# EAGLE schematic DSL 40 switcher MIDI external components (EAGLE 9.6.2)
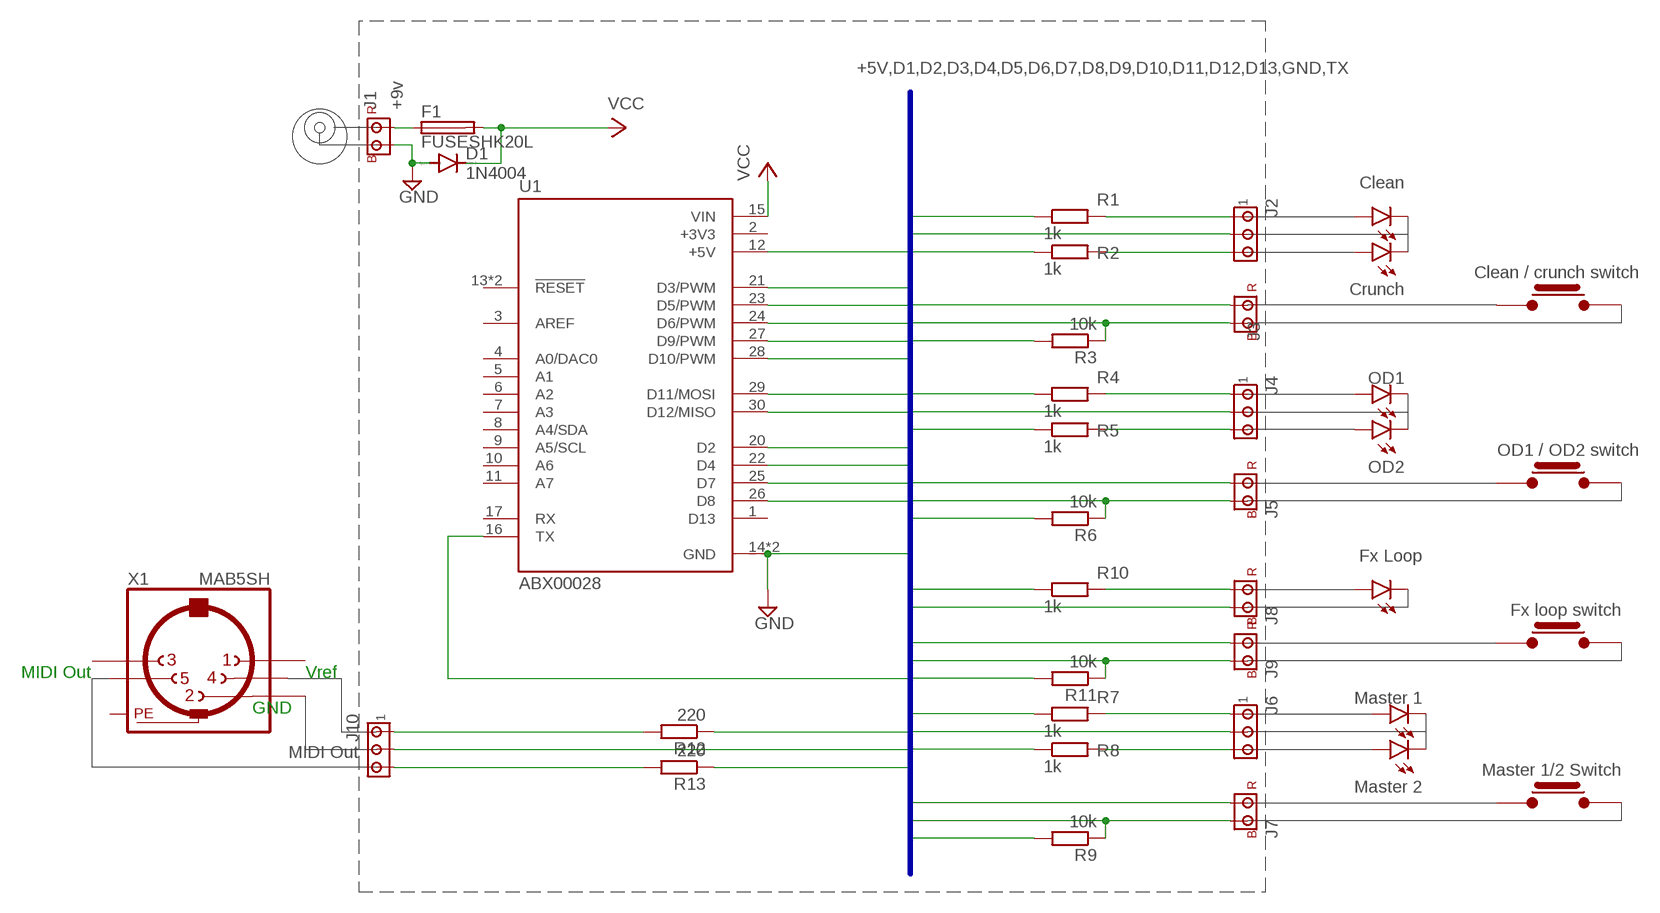
[diagram p0: schematic, sheet 1]

## Parts
D1  1N4004  [DO41-10]
F1  FUSESHK20L  [SHK20L]
J1  +9v  CONNECTOR-JST-2-2.54  [CONNECTOR-JST-2-2.54]
J2  Clean / crunch leds + synch ( 5 sec. )  CONNECTOR-JST-3-2.54  [CONNECTOR-JST-3-2.54]
J3  Clean / crunch switch  CONNECTOR-JST-2-2.54  [CONNECTOR-JST-2-2.54]
J4  OD1 / OD2 Led  CONNECTOR-JST-3-2.54  [CONNECTOR-JST-3-2.54]
J5  OD1 / OD2 switch  CONNECTOR-JST-2-2.54  [CONNECTOR-JST-2-2.54]
J6  Master 1 / 2 Led  CONNECTOR-JST-3-2.54  [CONNECTOR-JST-3-2.54]
J7  Master 1/2 Switch  CONNECTOR-JST-2-2.54  [CONNECTOR-JST-2-2.54]
J8  Fx loop Led  CONNECTOR-JST-2-2.54  [CONNECTOR-JST-2-2.54]
J9  Fx loop switch  CONNECTOR-JST-2-2.54  [CONNECTOR-JST-2-2.54]
J10  MIDI Out  CONNECTOR-JST-3-2.54  [CONNECTOR-JST-3-2.54]
J11  SWITCH-TEMPORARY-ON  [CONNECTOR-JST-2]
J12  SWITCH-TEMPORARY-ON  [CONNECTOR-JST-2]
J13  SWITCH-TEMPORARY-ON  [CONNECTOR-JST-2]
J14  SWITCH-TEMPORARY-ON  [CONNECTOR-JST-2]
LED1  Clean  LED3MM  [LED3MM]
LED2  Crunch  LED3MM  [LED3MM]
LED3  OD1  LED3MM  [LED3MM]
LED4  OD2  LED3MM  [LED3MM]
LED5  Fx Loop  LED3MM  [LED3MM]
LED6  Master 1  LED3MM  [LED3MM]
LED7  Master 2  LED3MM  [LED3MM]
R1  1k  R-EU_0207/10  [0207/10]
R2  1k  R-EU_0207/10  [0207/10]
R3  10k  R-EU_0207/10  [0207/10]
R4  1k  R-EU_0207/10  [0207/10]
R5  1k  R-EU_0207/10  [0207/10]
R6  10k  R-EU_0207/10  [0207/10]
R7  1k  R-EU_0207/10  [0207/10]
R8  1k  R-EU_0207/10  [0207/10]
R9  10k  R-EU_0207/10  [0207/10]
R10  1k  R-EU_0207/10  [0207/10]
R11  10k  R-EU_0207/10  [0207/10]
R12  220  R-EU_0207/10  [0207/10]
R13  220  R-EU_0207/10  [0207/10]
U1  ABX00028  [MODULE_ABX00028]
X1  MAB5SH  [MAB5SH]

## Nets
+5V: J3.RED J5.RED J7.RED J9.RED R12.1 U1.12(+5V)
D2: J3.BLACK R3.1 U1.20(D2)
D3: R2.1 U1.21(D3/PWM)
D4: R1.1 U1.22(D4)
D5: J5.BLACK R6.1 U1.23(D5/PWM)
D6: R5.1 U1.24(D6/PWM)
D7: R4.1 U1.25(D7)
D8: J7.BLACK R9.1 U1.26(D8)
D9: R8.1 U1.27(D9/PWM)
D10: R7.1 U1.28(D10/PWM)
D11: R10.1 U1.29(D11/MOSI)
D12: J9.BLACK R11.1 U1.30(D12/MISO)
GND: D1.A J1.BLACK J2.BLACK J4.BLACK J6.BLACK J8.BLACK J10.BLACK R3.2 R6.2 R9.2 R11.2 U1.14(GND) U1.19(GND)
N$1: J2.YELLOW R2.2
N$2: J2.RED R1.2
N$3: J4.YELLOW R5.2
N$4: J4.RED R4.2
N$5: J8.RED R10.2
N$6: J6.RED R7.2
N$7: J6.YELLOW R8.2
N$8: J10.RED R12.2
N$9: J10.YELLOW R13.2
N$10: F1.1A J1.RED
TX: R13.1 U1.16(TX)
VCC: D1.C F1.2A U1.15(VIN)
Unconnected: J11.BLACK J11.RED J12.BLACK J12.RED J13.BLACK J13.RED J14.BLACK J14.RED LED1.A LED1.K(C) LED2.A LED2.K(C) LED3.A LED3.K(C) LED4.A LED4.K(C) LED5.A LED5.K(C) LED6.A LED6.K(C) LED7.A LED7.K(C) U1.1(D13) U1.3(AREF) U1.4(A0/DAC0) U1.5(A1) U1.6(A2) U1.7(A3) U1.8(A4/SDA) U1.9(A5/SCL) U1.10(A6) U1.11(A7) U1.13(!RESET) U1.17(RX) U1.18(!RESET) X1.1 X1.2 X1.3 X1.4 X1.5

## Buses
+5V,D1,D2,D3,D4,D5,D6,D7,D8,D9,D10,D11,D12,D13,GND,TX

## Notes on the sheet
- MIDI Out | Vref
- GND

## Power pins joined to a net without a drawn wire
+3V3: U1.2(+3V3)
PE: X1.PE X1.PE@(PE)

## Library data of the parts
D1 = diode:1N4004: DIODE general purpose rectifier, 1 A
F1 = fuse:FUSE: Fuse; OC_FARNELL: unknown; OC_NEWARK: unknown
J1 J3 J5 J7-J9 = christophe:CONNECTOR-JST-2-2.54: AMP connector
J2 J4 J6 J10 = christophe:CONNECTOR-JST-3-2.54: AMP connector
J11-J14 = christophe:SWITCH-TEMPORARY-ON
LED1-LED7 = led:LED: LED OSRAM: - CHIPLED LG R971, LG N971, LY N971, LG Q971, LY Q971, LO R971, LY R971 LH N974, LH R974 LS Q976, LO Q976, LY Q976 LO Q996 - Hyper CHIPLED LW Q18S LB Q993, LB Q99A, LB R99A - SideLED LS A670, LO A670, LY A670, LG A670, LP A670 LB A673, LV A673, LT A673, LW A673 LH A674 LY A675 LS A676, LA A676, LO A676, LY A676, LW A676 LS A679, LY A679, LG A679 - Hyper Micro SIDELED® LS Y876, LA Y876, LO Y876, LY Y876 LT Y87S - SmartLED LW L88C, LW L88S LB L89C, LB L89S, LG L890 LS L89K, LO L89K, LY L89K LS L896, LA L896, LO L896, LY L896 - TOPLED LS T670, LO T670, LY T670, LG T670, LP T670 LSG T670, LSP T670, LSY T670, LOP T670, LYG T670 LG T671, LOG T671, LSG T671 LB T673, LV T673, LT T673, LW T673 LH T674 LS T676, LA T676, LO T676, LY T676, LB T676, LH T676, LSB T676, LW T676 LB T67C, LV T67C, LT T67C, LS T67K, LO T67K, LY T67K, LW E67C LS E67B, LA E67B, LO E67B, LY E67B, LB E67C, LV E67C, LT E67C LW T67C LS T679, LY T679, LG T679 LS T770, LO T770, LY T770, LG T770, LP T770 LB T773, LV T773, LT T773, LW T773 LH T774 LS E675, LA E675, LY E675, LS T675 LS T776, LA T776, LO T776, LY T776, LB T776 LHGB T686 LT T68C, LB T68C - Hyper Mini TOPLED® LB M676 - Mini TOPLED Santana® LG M470 LS M47K, LO M47K, LY M47K Source: http://www.osram.convergy.de LUXEON: - LUMILED® LXK2-PW12-R00, LXK2-PW12-S00, LXK2-PW14-U00, LXK2-PW14-V00 LXK2-PM12-R00, LXK2-PM12-S00, LXK2-PM14-U00 LXK2-PE12-Q00, LXK2-PE12-R00, LXK2-PE12-S00, LXK2-PE14-T00, LXK2-PE14-U00 LXK2-PB12-K00, LXK2-PB12-L00, LXK2-PB12-M00, LXK2-PB14-N00, LXK2-PB14-P00, LXK2-PB14-Q00 LXK2-PR12-L00, LXK2-PR12-M00, LXK2-PR14-Q00, LXK2-PR14-R00 LXK2-PD12-Q00, LXK2-PD12-R00, LXK2-PD12-S00 LXK2-PH12-R00, LXK2-PH12-S00 LXK2-PL12-P00, LXK2-PL12-Q00, LXK2-PL12-R00 Source: www.luxeon.com KINGBRIGHT: KA-3528ASYC Source: www.kingbright.com
R1-R13 = christophe:R-EU_: RESISTOR, European symbol; SPICEPREFIX: R
U1 = Arduino every:ABX00028: Check availability <https://pricing.snapeda.com/parts/Arduino%20Nano%20Every/Arduino/view-part?ref=eda>; AVAILABILITY: In Stock; CHECK_PRICES: https://www.snapeda.com/parts/Arduino%20Nano%20Every/Arduino/view-part/?ref=eda; DESCRIPTION: Arduino’s 5V compatible board in the smallest available form factor: 45x18mm!; MF: Arduino; MP: Arduino Nano Every; PACKAGE: None; PRICE: None; SNAPEDA_LINK: https://www.snapeda.com/parts/Arduino%20Nano%20Every/Arduino/view-part/?ref=snap
X1 = con-hirschmann:MAB5SH: Female CONNECTOR 5 pins 90 deg. with shield, horizontal (DIN 41524); OC_FARNELL: 809883; OC_NEWARK: unknown